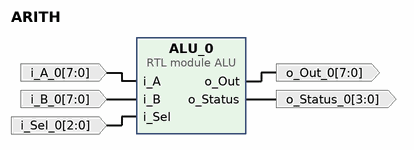
[diagram p0: block diagram of the top level]
# Vivado block design ARITH, xc7z007sclg400-1, Vivado 2018.2
create_bd_design ARITH

create_bd_port -dir I -from 7 -to 0 i_A_0
create_bd_port -dir I -from 7 -to 0 i_B_0
create_bd_port -dir I -from 2 -to 0 i_Sel_0
create_bd_port -dir O -from 3 -to 0 o_Status_0
create_bd_port -dir O -from 7 -to 0 o_Out_0

create_bd_cell -type module -reference ALU ALU_0

# ---- connections ----

connect_bd_net -net i_A_0_1 [get_bd_ports i_A_0] [get_bd_pins ALU_0/i_A]
connect_bd_net -net i_B_0_1 [get_bd_ports i_B_0] [get_bd_pins ALU_0/i_B]
connect_bd_net -net i_Sel_0_1 [get_bd_ports i_Sel_0] [get_bd_pins ALU_0/i_Sel]
connect_bd_net [get_bd_pins ALU_0/o_Status] [get_bd_ports o_Status_0]
connect_bd_net [get_bd_pins ALU_0/o_Out] [get_bd_ports o_Out_0]

validate_bd_design
save_bd_design
